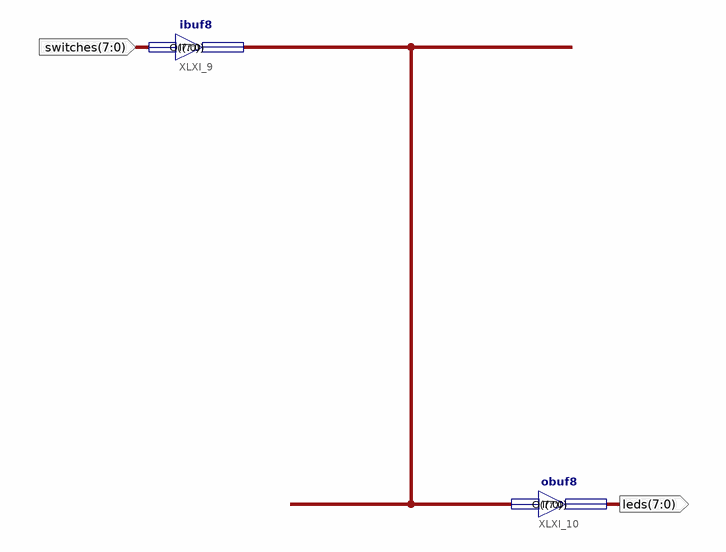
[diagram p0: schematic sheet 1]
// Xilinx ISE schematic toplevel.sch (spartan6) as structural Verilog: 2 symbols, 2 ports
module toplevel (
  input  [7:0] switches,
  output [7:0] leds
);

  wire [7:0] XLXN_3;

  ibuf8 XLXI_9 (.I(switches), .O(XLXN_3));
  obuf8 XLXI_10 (.I(XLXN_3), .O(leds));
endmodule
